# Altium project PCB_Project_2.PrjPcb
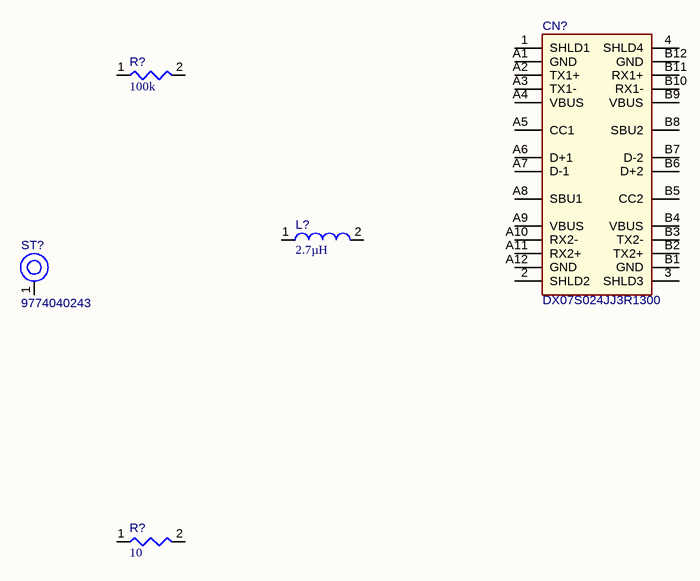
[diagram p0: Sheet1.SchDoc]
1 sheet, 5 parts. Net scope: global (net labels, ports and power ports of the same name join across sheets).
Board file: PCB1.PcbDoc

## Sheet Sheet1.SchDoc
size A

### Parts
(Parts that share a designator on the sheet are numbered #1, #2 ... from top to bottom, then left to right.)
CN?  DX07S024JJ3R1300  [JAE-DX07S024JJ3_V]
L?  value 2.7µH  [TDK-VLCF5028-2_V]  (hidden comment: VLCF5028T-2R7N1R8-2)
R?#1  value 100k  [RESC1005X40X25ML05T05]  (hidden comment: Resistor 100k +/-1% 0402 100 mW)
R?#2  value 10  [RESC0402(1005)_L]  (hidden comment: Resistor 10R  +/-1 % 0402 63 mW)
ST?  9774040243  [WE-9774040243_V]

### Nets

Not connected (* = marked no-connect by the designer): CN? 1(SHLD1) 2(SHLD2) 3(SHLD3) 4(SHLD4) A1(GND) A2(TX1+) A3(TX1-) A4(VBUS) A5(CC1) A6(D+1) A7(D-1) A8(SBU1) A9(VBUS) A10(RX2-) A11(RX2+) A12(GND) B1(GND) B2(TX2+) B3(TX2-) B4(VBUS) B5(CC2) B6(D+2) B7(D-2) B8(SBU2) B9(VBUS) B10(RX1-) B11(RX1+) B12(GND); L? 1 2; R?#1 1 2; R?#2 1 2; ST? 1(H1)

### Library data of the parts
CN? = CMP-002-00065-1: USB-C Connector, 20 V, 1.25 A, -30 to 80 degC, RoHS, Tape and Reel; Gender: Receptacle; Connector Type: USB-C; Pins: 28
L? = CMP-006-00017-4: Inductor for Power Circuits, 2.7 uH, +/- 30%,100 KHz, 1.82 A, -40 to 105 degC, 2-Pin SMD, RoHS, Reel; Manufacturer: TDK; Shielding: Shielded; Core Material: Ferrite; Resistance: 0.033Ohm; Saturation Current: 1.82A; Package Quantity: 500; Datasheet URL: https://product.tdk.com/info/en/catalog/datasheets/inductor_commercial_power_vlcf5028-2_en.pdf; Inductance Tolerance: 30%; Datasheet Version: Apr-16; Packaging: TapeandReel; Case/Package: 5028; Package Reference: VLCF5028-2; Tolerance: 30%; Max Operating Temperature: 105°C; RoHS Compliant: True; Min Operating Temperature: -40°C; Mounting Technology: SM; Package Description: 2-Pin Surface Mount Device, Body 5.2 x 5.3 mm; Current Rating: 1.82A
R?#1 = CMP-009-00022-4: Chip Resistor, 100 KOhm, +/- 1%, 0.1 W, -55 to 155 degC, 0402 (1005 Metric); Power: 100mW; Voltage Rating: 50V; Pins: 2; Tolerance: 1%; Min Operating Temperature: -55°C; RoHS Compliant: True; Mounting Technology: SM; Max Operating Temperature: 155°C; Case/Package: 0402
R?#2 = CMP-009-00152-2: Chip Resistor, 10 Ohms, +/-1 %, 63 mW, -55 to 155 degC, 0402; Power: 63mW; Tolerance: 1%; Min Operating Temperature: -55°C; Pins: 2; Max Operating Temperature: 155°C; Case/Package: 0402
ST? = CMP-00028-00003-1: WA-SMSI SMT Steel Spacer, M2 Thread Internal, Tin, RoHS, Tape and Reel; Pins: 1